# Altium schematic sheet STM32F411CEU6.SchDoc (part 3 of 3)
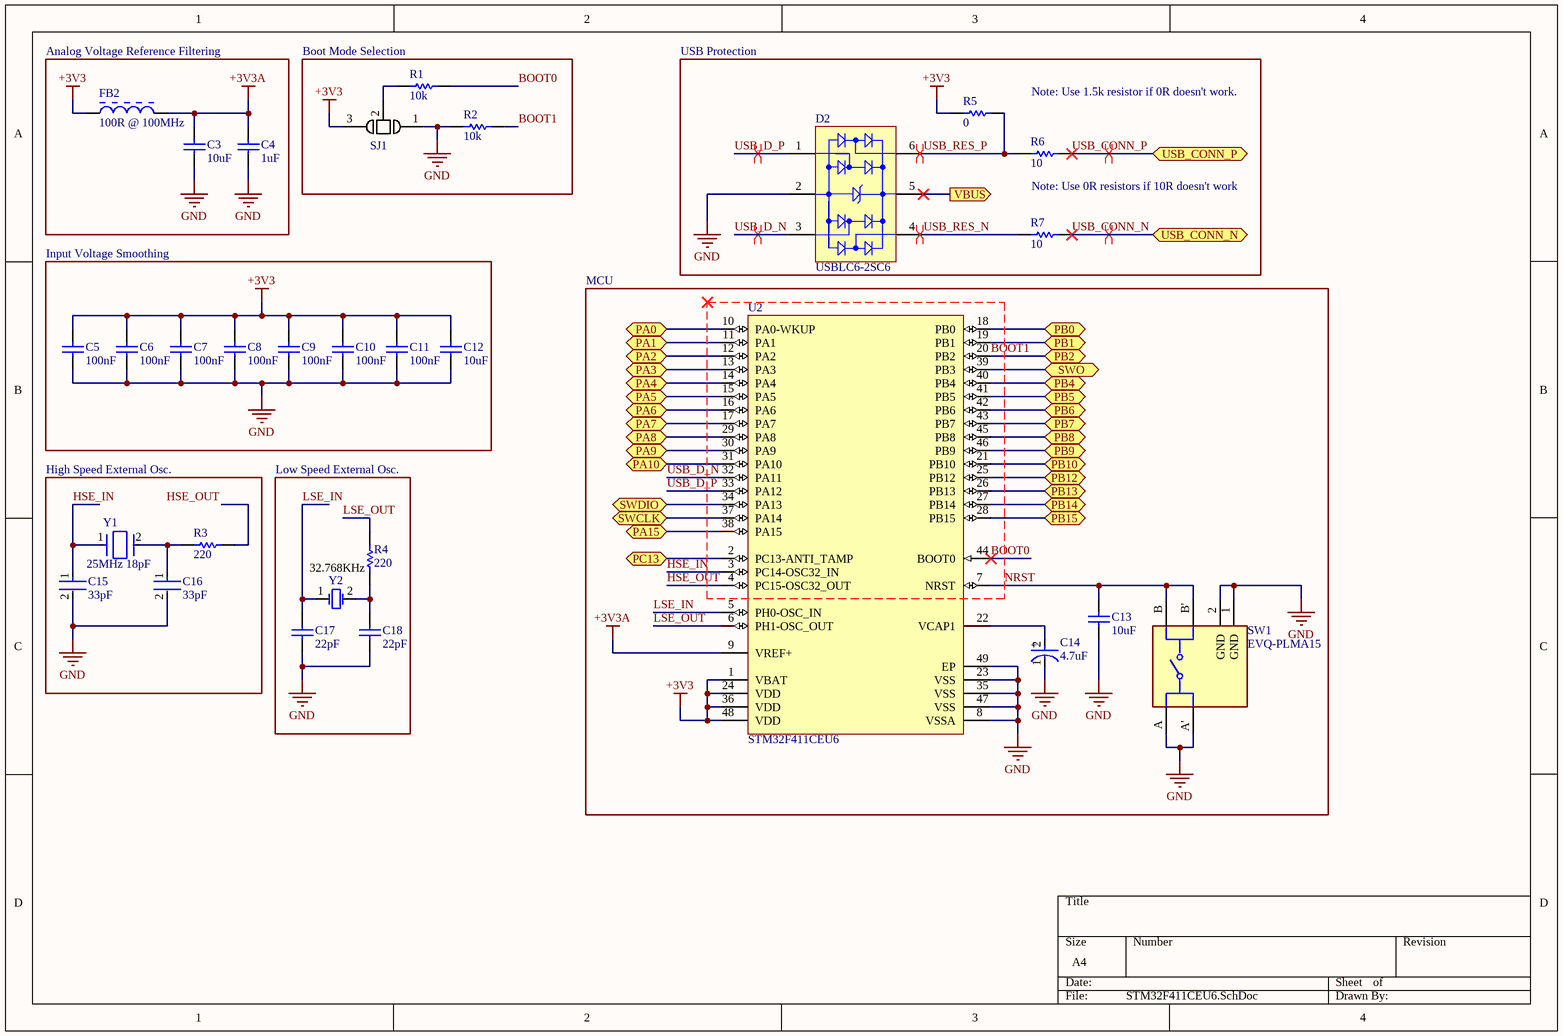
[diagram p2: STM32F411CEU6.SchDoc]

## Library data of the parts (continued)
U2 = CMP-0243-00165-1: ARM Cortex-M4 32-bit MCU+FPU, 512 KB Flash, 128 KB RAM, 36 I/Os, 48-Pin UFQFPN, -40 to 85 degC, Tray; Manufacturer: STMicroelectronics; Operating Frequency(F) (Processor speed) (MHz): 100; FLASH Size (Prog) (kB): 512; Internal RAM Size (kB): 128; I/Os (High Current): 36; Supply Voltage(Vcc) min (V): 1.7; Interface: I2C,SPI,USB,IrDA,MMC,SDIO,SD,UART,USART,LIN,I2S; Frequency: 100MHz; Oscillator Type: Internal; Memory Size: 512KB; Peripherals: Brown-out Detect/Reset,POR,PWM,WDT,DMA; RAM Size: 128KB; Max Power Dissipation: 625mW; Number of Timers/Counters: 8; Min Supply Voltage: 1.7V; Max Supply Voltage: 3.6V; Data Bus Width: 32b; Watchdog Timer: Yes; Number of ADC Channels: 16; Operating Supply Voltage: 3.3V; Package Reference: 48-Pin Ultra Thin Fine Pitch Quad Flat No-Lead, 7 x 7 x 0.6 mm Body, 0.5 mm Pitch, Exposed Pad; ComponentLink1Description: Manufacturer URL; ComponentLink1URL: http://www.st.com/; Packing: Tray; Package Description: UFQFPN48; Core: ARM Cortex-M4; ComponentLink2Description: Datasheet; ComponentLink2URL: http://www.st.com/st-web-ui/static/active/en/resource/technical/document/datasheet/DM00115249.pdf; DatasheetVersion: Rev. 6; Mounting Technology: Surface Mount; Supplier 1: Digi-Key; Supplier Part Number 1: 497-14907-ND; Manufacturer Part Number: STM32F411CEU6; RoHS: Yes; Category: Microcontrollers; Stock 1: 12249; Pricing 1: 1=6.25000, 10=5.65000, 25=5.38680, 100=4.67730, 250=4.46708, 500=4.07294, 1000=3.54740, 2500=3.41601, 5000=3.28463 (USD); Mount: Surface Mount; Case/Package: UFQFPN; Number of Pins: 48; Min Operating Temperature: -40°C; Max Operating Temperature: 85°C; Packaging: Tray; Number of I/Os: 36; Memory Type: FLASH; Core Architecture: ARM; Number of Programmable I/O: 36; Max Frequency: 100MHz; Package Quantity: 1560; Length: 7mm; Width: 7mm; Radiation Hardening: No; Lead Free: Lead Free; REACH SVHC: No SVHC; ComponentLink3URL: http://www.farnell.com/datasheets/1869644.pdf?src-supplier=Farnell; ComponentLink3Description: http://www.farnell.com/datasheets/1869644.pdf?src-supplier=Farnell; ComponentLink4URL: http://www.mouser.com/ds/2/389/stm32f411ce-956237.pdf?src-supplier=Mouser; ComponentLink4Description: http://www.mouser.com/ds/2/389/stm32f411ce-956237.pdf?src-supplier=Mouser; ComponentLink5URL: http://www.farnell.com/datasheets/1869644.pdf?src-supplier=Element14; ComponentLink5Description: http://www.farnell.com/datasheets/1869644.pdf?src-supplier=Element14; ComponentLink6URL: http://www.st.com/content/ccc/resource/technical/document/datasheet/b3/a5/46/3b/b4/e5/4c/85/DM00115249.pdf/files/DM00115249.pdf/jcr:content/translations/en.DM00115249.pdf?src-supplier=Digi-Key; ComponentLink6Description: http://www.st.com/content/ccc/resource/technical/document/datasheet/b3/a5/46/3b/b4/e5/4c/85/DM00115249.pdf/files/DM00115249.pdf/jcr:content/translations/en.DM00115249.pdf?src-supplier=Digi-Key; ComponentLink7URL: http://www.st.com/st-web-ui/static/active/en/resource/technical/document/datasheet/DM00115249.pdf?src-supplier=Avnet; ComponentLink7Description: http://www.st.com/st-web-ui/static/active/en/resource/technical/document/datasheet/DM00115249.pdf?src-supplier=Avnet; Supplier 2: LCSC; Supplier Part Number 2: C60420; Stock 2: 1078; Pricing 2: 1=3.96450, 10=2.88130, 30=2.68340, 100=2.48540, 500=2.39680, 1000=2.35260, 1=3.69050, 10=2.68220, 30=2.49790, 100=2.31360, 500=2.23120, 1000=2.19000, 1=19.19500, 10=13.95080, 30=12.99220, 100=12.03360, 500=11.60500, 1000=11.39070, 1=17.94260, 10=13.04050, 30=12.14440, 100=11.24840, 500=10.84780, 1000=10.64750, 1=2.40690, 10=1.74930, 30=1.62910, 100=1.50890, 500=1.45520, 1000=1.42830, 1=2.16440, 10=1.57310, 30=1.46500, 100=1.35690, 500=1.30860, 1000=1.28440, 1=20.98610, 10=15.25250, 30=14.20450, 100=13.15640, 500=12.68780, 1000=12.45360, 1=290.45250, 10=211.09860, 30=196.59300, 100=182.08740, 500=175.60250, 1000=172.36020, 1=11.59710, 10=8.42870, 30=7.84950, 100=7.27040, 500=7.01140, 1000=6.88200, 1=188.93140, 10=137.31390, 30=127.87840, 100=118.44290, 500=114.22470, 1000=112.11560, 1=25.31950, 10=18.40200, 30=17.13750, 100=15.87300, 500=15.30770, 1000=15.02510, 1=3.77600, 10=2.74430, 30=2.55580, 100=2.36720, 500=2.28290, 1000=2.24070, 1=2.70773, 10=1.96796, 30=1.83273, 100=1.69750, 500=1.63705, 1000=1.60682 (AUD)
Y1 = CMP-18717-000008-1: CRYSTAL 25.0000MHZ 18PF SMD; Manufacturer: TXC; Manufacturer Part Number: 7A-25.000MAAJ-T; Frequency Tolerance: 30ppm; ESR (Equivalent Series Resistance): 50R; Load Capacitance: 18pF; Width: 0.126inch; REACH SVHC: No SVHC; Max Operating Temperature: 70°C; Case/Package: SMD/SMT; Length: 5mm; Height: 0.053inch; Number of Pins: 2; Frequency: 25MHz; Packaging: Tape and Reel; Termination: SMD/SMT; Mount: Surface Mount; Depth: 3.2mm; Tolerance: 30ppm; Min Operating Temperature: -40°C; Package Quantity: 1000; Lead Free: Lead Free; Frequency Stability: 30ppm; Supplier 1: Digi-Key; Supplier Part Number 1: 887-1092-1-ND; RoHS: Yes; Category: Crystals; Stock 1: 30556; Pricing 1: 1=0.72000, 10=0.63300, 50=0.59120, 100=0.52250, 500=0.49500 (USD); ComponentLink1URL: https://datasheet.ciiva.com/26918/getdatasheetpartid-757028-26918812.pdf?src-supplier=Verical; ComponentLink1Description: https://datasheet.ciiva.com/26918/getdatasheetpartid-757028-26918812.pdf?src-supplier=Verical; ComponentLink2URL: https://datasheet.ciiva.com/854/7a-854752.pdf?src-supplier=Digi-Key; ComponentLink2Description: https://datasheet.ciiva.com/854/7a-854752.pdf?src-supplier=Digi-Key; ComponentLink3URL: https://datasheet.ciiva.com/22698/1041607-22698734.pdf?src-supplier=Element14; ComponentLink3Description: https://datasheet.ciiva.com/22698/1041607-22698734.pdf?src-supplier=Element14; ComponentLink4URL: https://datasheet.ciiva.com/854/7a-854751.pdf?src-supplier=Digi-Key; ComponentLink4Description: https://datasheet.ciiva.com/854/7a-854751.pdf?src-supplier=Digi-Key; ComponentLink5URL: https://datasheet.ciiva.com/854/7a-854753.pdf?src-supplier=Digi-Key; ComponentLink5Description: https://datasheet.ciiva.com/854/7a-854753.pdf?src-supplier=Digi-Key; ComponentLink6URL: https://datasheet.ciiva.com/46431/1041607-46431975.pdf?src-supplier=Element14; ComponentLink6Description: https://datasheet.ciiva.com/46431/1041607-46431975.pdf?src-supplier=Element14; ComponentLink7URL: https://datasheet.ciiva.com/1356/1041607-1356398.pdf?src-supplier=Element14; ComponentLink7Description: https://datasheet.ciiva.com/1356/1041607-1356398.pdf?src-supplier=Element14
Y2 = CMP-2000-05089-1: Turning Fork Crystal Unit, 32.768 KHz, -40 to 85 degC, 2-Pin SMD, RoHS, Tape and Reel; Manufacturer: Citizen Micro HumanTech; Manufacturer Part Number: CM315D32768DZFT; Package Version: Rev. 1.4, 09/2012; Load Capacitance: 12.5pF; Frequency Tolerance: 20ppm; ESR (Equivalent Series Resistance): 70kR; Package Reference: CM315D-2; Package Description: 2-Pin Surface Mount Device, Body 1.6 x 3.3 mm, Pitch 2.5 mm; Package URL: http://cfm.citizen.co.jp/english/product/pdf/CM315D.pdf; Manufacturer URL: http://www.citizen-systems.com/us/start; Datasheet Version: Rev. 1.4, 09/2012; Datasheet URL: http://cfm.citizen.co.jp/english/product/pdf/CM315D.pdf; Supplier 1: Digi-Key; Supplier Part Number 1: 300-8814-1-ND; RoHS: Yes; Category: Crystals; Stock 1: 29860; Pricing 1: 1=0.72000, 10=0.63800, 50=0.59600, 100=0.52670, 500=0.49896, 1000=0.41580 (USD); Mount: Surface Mount; Case/Package: 1206; Case Code (Metric): 3216; Case Code (Imperial): 1206; Min Operating Temperature: -40°C; Max Operating Temperature: 85°C; Frequency: 32.768kHz; Packaging: Tape and Reel; Package Quantity: 3000; Length: 0.126inch; Height: 0.035inch; Width: 0.059inch; Lead Free: Lead Free; ComponentLink1URL: https://datasheet.ciiva.com/16437/cm315-16437047.pdf?src-supplier=Future+Electronics; ComponentLink1Description: https://datasheet.ciiva.com/16437/cm315-16437047.pdf?src-supplier=Future+Electronics; Supplier 2: LCSC; Supplier Part Number 2: C182057; Stock 2: 48197; Pricing 2: 1=0.31270, 10=0.23190, 30=0.21710, 100=0.20220, 500=0.19560, 1000=0.19230, 1=0.29130, 10=0.21600, 30=0.20220, 100=0.18840, 500=0.18220, 1000=0.17920, 1=1.51960, 10=1.12690, 30=1.05470, 100=0.98260, 500=0.95040, 1000=0.93470, 1=1.42220, 10=1.05470, 30=0.98710, 100=0.91960, 500=0.88960, 1000=0.87480, 1=0.19080, 10=0.14150, 30=0.13240, 100=0.12340, 500=0.11930, 1000=0.11730, 1=0.17100, 10=0.12680, 30=0.11870, 100=0.11060, 500=0.10700, 1000=0.10520, 1=1.66080, 10=1.23160, 30=1.15270, 100=1.07390, 500=1.03880, 1000=1.02150, 1=22.88140, 10=16.96830, 30=15.88110, 100=14.79560, 500=14.31150, 1000=14.07370, 1=0.91740, 10=0.68030, 30=0.63670, 100=0.59320, 500=0.57380, 1000=0.56430, 1=14.94610, 10=11.08370, 30=10.37350, 100=9.66450, 500=9.34830, 1000=9.19290, 1=2.00280, 10=1.48520, 30=1.39010, 100=1.29510, 500=1.25270, 1000=1.23190, 1=0.29890, 10=0.22160, 30=0.20740, 100=0.19330, 500=0.18690, 1000=0.18380, 1=0.21430, 10=0.15892, 30=0.14873, 100=0.13857, 500=0.13403, 1000=0.13181 (AUD)